# Altium schematic sheet memory.SchDoc
size C
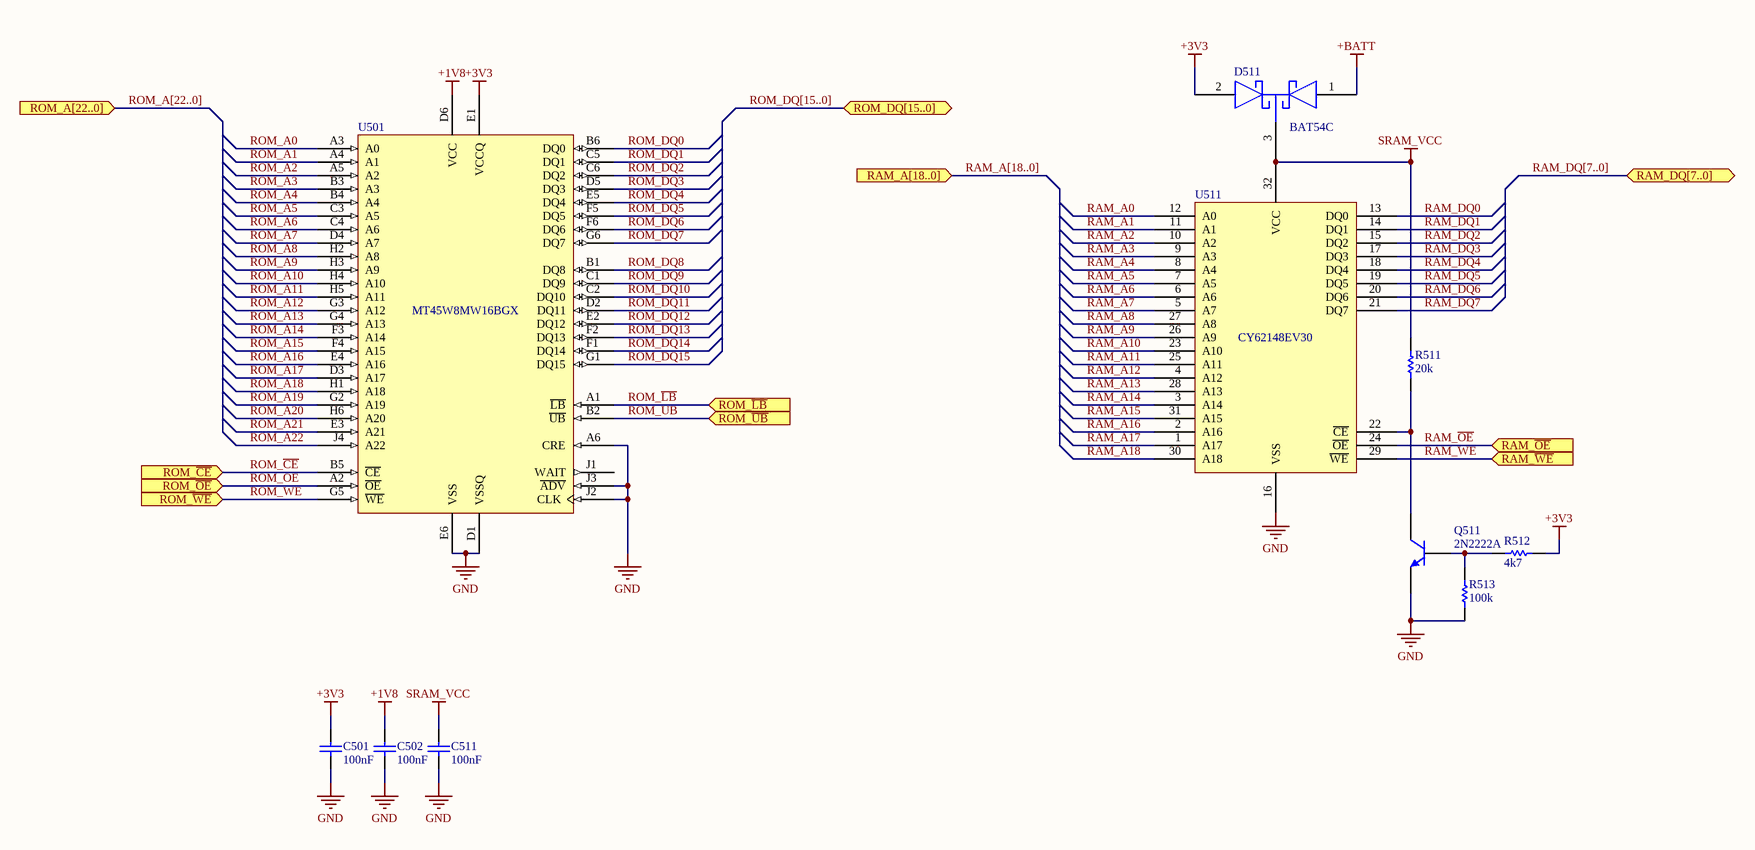
[diagram p0: memory.SchDoc]

## Parts
C501  100nF  [SM0805]
C502  100nF  [SM0805]
C511  100nF  [SM0805]
D511  BAT54C  [SOT23EBC]
Q511  2N2222A  [SOT23EBC]
R511  20k  [SM0805]
R512  4k7  [SM0805]
R513  100k  [SM0805]
U501  MT45W8MW16BGX  [VFBGA54]
U511  CY62148EV30  [TSOPII-32]

## Ports
RAM_A[18..0] (in), RAM_DQ[7..0] (bidir), RAM_~{OE} (in), RAM_~{WE} (in), ROM_A[22..0] (in), ROM_DQ[15..0] (bidir), ROM_~{CE} (in), ROM_~{LB} (in), ROM_~{OE} (in), ROM_~{UB} (in), ROM_~{WE} (in)

## Nets
+1V8: C502.1 U501.D6(VCC)
+3V3: C501.1 D511.2 R512.2 U501.E1(VCCQ)
+BATT: D511.1
GND: C501.2 C502.2 C511.2 Q511.2(E) R513.2 U501.A6(CRE) U501.D1(VSSQ) U501.E6(VSS) U501.J2(CLK) U501.J3(~{ADV}) U511.16(VSS)
SRAM_VCC: C511.1 D511.3 R511.1 U511.32(VCC)
RAM_A0: U511.12(A0)
RAM_A1: U511.11(A1)
RAM_A2: U511.10(A2)
RAM_A3: U511.9(A3)
RAM_A4: U511.8(A4)
RAM_A5: U511.7(A5)
RAM_A6: U511.6(A6)
RAM_A7: U511.5(A7)
RAM_A8: U511.27(A8)
RAM_A9: U511.26(A9)
RAM_A10: U511.23(A10)
RAM_A11: U511.25(A11)
RAM_A12: U511.4(A12)
RAM_A13: U511.28(A13)
RAM_A14: U511.3(A14)
RAM_A15: U511.31(A15)
RAM_A16: U511.2(A16)
RAM_A17: U511.1(A17)
RAM_A18: U511.30(A18)
RAM_DQ0: U511.13(DQ0)
RAM_DQ1: U511.14(DQ1)
RAM_DQ2: U511.15(DQ2)
RAM_DQ3: U511.17(DQ3)
RAM_DQ4: U511.18(DQ4)
RAM_DQ5: U511.19(DQ5)
RAM_DQ6: U511.20(DQ6)
RAM_DQ7: U511.21(DQ7)
RAM_~{OE}: U511.24(~{OE}) ; port RAM_~{OE}
RAM_~{WE}: U511.29(~{WE}) ; port RAM_~{WE}
ROM_A0: U501.A3(A0)
ROM_A1: U501.A4(A1)
ROM_A2: U501.A5(A2)
ROM_A3: U501.B3(A3)
ROM_A4: U501.B4(A4)
ROM_A5: U501.C3(A5)
ROM_A6: U501.C4(A6)
ROM_A7: U501.D4(A7)
ROM_A8: U501.H2(A8)
ROM_A9: U501.H3(A9)
ROM_A10: U501.H4(A10)
ROM_A11: U501.H5(A11)
ROM_A12: U501.G3(A12)
ROM_A13: U501.G4(A13)
ROM_A14: U501.F3(A14)
ROM_A15: U501.F4(A15)
ROM_A16: U501.E4(A16)
ROM_A17: U501.D3(A17)
ROM_A18: U501.H1(A18)
ROM_A19: U501.G2(A19)
ROM_A20: U501.H6(A20)
ROM_A21: U501.E3(A21)
ROM_A22: U501.J4(A22)
ROM_~{CE}: U501.B5(~{CE}) ; port ROM_~{CE}
ROM_DQ0: U501.B6(DQ0)
ROM_DQ1: U501.C5(DQ1)
ROM_DQ2: U501.C6(DQ2)
ROM_DQ3: U501.D5(DQ3)
ROM_DQ4: U501.E5(DQ4)
ROM_DQ5: U501.F5(DQ5)
ROM_DQ6: U501.F6(DQ6)
ROM_DQ7: U501.G6(DQ7)
ROM_DQ8: U501.B1(DQ8)
ROM_DQ9: U501.C1(DQ9)
ROM_DQ10: U501.C2(DQ10)
ROM_DQ11: U501.D2(DQ11)
ROM_DQ12: U501.E2(DQ12)
ROM_DQ13: U501.F2(DQ13)
ROM_DQ14: U501.F1(DQ14)
ROM_DQ15: U501.G1(DQ15)
ROM_~{LB}: U501.A1(~{LB}) ; port ROM_~{LB}
ROM_~{OE}: U501.A2(~{OE}) ; port ROM_~{OE}
ROM_~{UB}: U501.B2(~{UB}) ; port ROM_~{UB}
ROM_~{WE}: U501.G5(~{WE}) ; port ROM_~{WE}
NetQ511_1: Q511.1(B) R512.1 R513.1
NetQ511_3: Q511.3(C) R511.2 U511.22(~{CE})

Not connected (* = marked no-connect by the designer): U501 J1(WAIT)

## Buses and harness runs
bus RAM_A[18..0] = port RAM_A[18..0]
bus RAM_DQ[7..0] = port RAM_DQ[7..0]
bus ROM_A[22..0] = port ROM_A[22..0]
bus ROM_DQ[15..0] = port ROM_DQ[15..0]

## Library data of the parts
C501 C502 C511 = Cap: Capacitor; Value: 100nF
Q511 = NPN: NPN Transistor
R511-R513 = Res1: Resistor
  R511: Value: 20k
  R512: Value: 4k7
  R513: Value: 100k